# Altium schematic sheet J-Link-OB.SchDoc
size A3; SheetNumber: 8; SheetTotal: 8; DocumentSheetName: J-Link OB
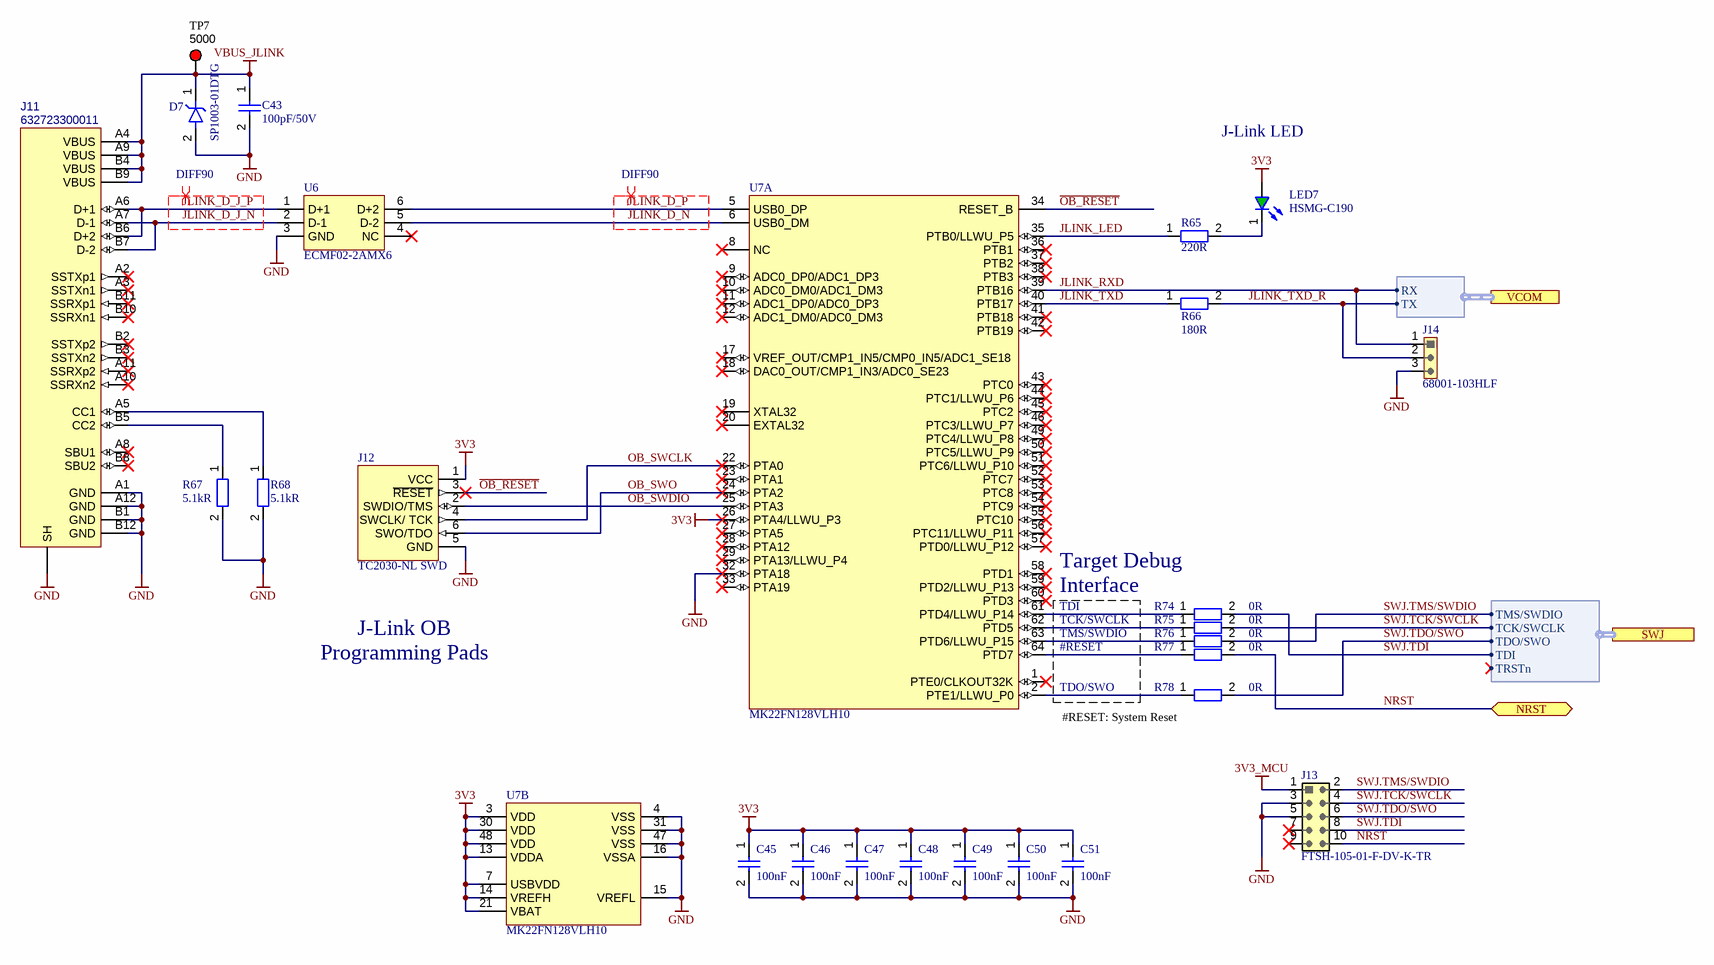
[diagram p0: J-Link-OB.SchDoc]

## Parts
C43  100pF/50V  [CAPC1005X50N]
C45  value 100nF  [CAPC1005X50N]  (hidden comment: 100nF/16V)
C46  value 100nF  [CAPC1005X50N]  (hidden comment: 100nF/16V)
C47  value 100nF  [CAPC1005X50N]  (hidden comment: 100nF/16V)
C48  value 100nF  [CAPC1005X50N]  (hidden comment: 100nF/16V)
C49  value 100nF  [CAPC1005X50N]  (hidden comment: 100nF/16V)
C50  value 100nF  [CAPC1005X50N]  (hidden comment: 100nF/16V)
C51  value 100nF  [CAPC1005X50N]  (hidden comment: 100nF/16V)
D7  SP1003-01DTG  [SOD14060X55N]
J11  632723300011  [WE_632723300011]
J12  TC2030-NL SWD  [TC2030-NL]  (no BOM)
J13  FTSH-105-01-F-DV-K-TR  [FP-FTSH-105-01-F-DV-K-TR-MFG]
J14  68001-103HLF  [HD254_1x3_MV]
LED7  HSMG-C190  [LEDSC160X80X80-2Lgn]
R65  220R  [RESC1608X45N]
R66  180R  [RESC1608X45N]
R67  5.1kR  [RESC1005X35N]
R68  5.1kR  [RESC1005X35N]
R74  0R  [RESC1005X35N]
R75  0R  [RESC1005X35N]
R76  0R  [RESC1005X35N]
R77  0R  [RESC1005X35N]
R78  0R  [RESC1005X35N]
TP7  5000  [KSTN-5000]
U6  ECMF02-2AMX6  [QFN50P150X170X50-6N]
U7  MK22FN128VLH10  [QFP50P1200X1200X160-64L]  (parts A,B of 2)

## Ports
NRST (bidir), SWJ (harness SWJ), VCOM (harness VCOM)

## Harnesses
VCOM: RX, TX
SWJ: TMS/SWDIO, TCK/SWCLK, TDO/SWO, TDI, TRSTn

## Nets
3V3: C45.1 C46.1 C47.1 C48.1 C49.1 C50.1 C51.1 J12.1(VCC) LED7.2(A) U7.3(VDD) U7.7(USBVDD) U7.13(VDDA) U7.14(VREFH) U7.21(VBAT) U7.26(PTA4/LLWU_P3) U7.30(VDD) U7.48(VDD)
3V3_MCU: J13.1
GND: C43.2 C45.2 C46.2 C47.2 C48.2 C49.2 C50.2 C51.2 D7.2(A) J11.A1(GND) J11.A12(GND) J11.B1(GND) J11.B12(GND) J11.SH J12.5(GND) J13.3 J13.5 J14.3 R67.2 R68.2 U6.3(GND) U7.4(VSS) U7.15(VREFL) U7.16(VSSA) U7.31(VSS) U7.32(PTA18) U7.47(VSS)
VBUS_JLINK: C43.1 D7.1(A) J11.A4(VBUS) J11.A9(VBUS) J11.B4(VBUS) J11.B9(VBUS) TP7.1
JLINK_D_J_N: J11.A7(D-1) J11.B7(D-2) U6.2(D-1)
JLINK_D_J_P: J11.A6(D+1) J11.B6(D+2) U6.1(D+1)
JLINK_D_N: U6.5(D-2) U7.6(USB0_DM)
JLINK_D_P: U6.6(D+2) U7.5(USB0_DP)
JLINK_LED: R65.1 U7.35(PTB0/LLWU_P5)
JLINK_RXD: J14.1 U7.39(PTB16) ; port VCOM.RX
JLINK_TXD: R66.1 U7.40(PTB17)
JLINK_TXD_R: J14.2 R66.2 ; port VCOM.TX
NRST: J13.10 R77.2 ; port NRST
~{OB_RESET}: J12.3(~{RESET}) U7.34(RESET_B)
OB_SWCLK: J12.4(SWCLK/_TCK) U7.22(PTA0)
OB_SWDIO: J12.2(SWDIO/TMS) U7.25(PTA3)
OB_SWO: J12.6(SWO/TDO) U7.24(PTA2)
SWJ.TCK/SWCLK: J13.4 R75.2 ; port SWJ.TCK/SWCLK
SWJ.TDI: J13.8 R74.2 ; port SWJ.TDI
SWJ.TDO/SWO: J13.6 R78.2 ; port SWJ.TDO/SWO
SWJ.TMS/SWDIO: J13.2 R76.2 ; port SWJ.TMS/SWDIO
NetJ11_A5: J11.A5(CC1) R68.1
NetJ11_B5: J11.B5(CC2) R67.1
NetLED7_1: LED7.1(K) R65.2
NetR74_1: R74.1 U7.61(PTD4/LLWU_P14)
NetR75_1: R75.1 U7.62(PTD5)
NetR76_1: R76.1 U7.63(PTD6/LLWU_P15)
NetR77_1: R77.1 U7.64(PTD7)
NetR78_1: R78.1 U7.2(PTE1/LLWU_P0)

Not connected (* = marked no-connect by the designer): J11 A2(SSTXp1)* A3(SSTXn1)* A8(SBU1)* A10(SSRXn2)* A11(SSRXp2)* B2(SSTXp2)* B3(SSTXn2)* B8(SBU2)* B10(SSRXn1)* B11(SSRXp1)*; J13 7* 9*; U6 4(NC)*; U7 1(PTE0/CLKOUT32K)* 8(NC)* 9(ADC0_DP0/ADC1_DP3)* 10(ADC0_DM0/ADC1_DM3)* 11(ADC1_DP0/ADC0_DP3)* 12(ADC1_DM0/ADC0_DM3)* 17(VREF_OUT/CMP1_IN5/CMP0_IN5/ADC1_SE18)* 18(DAC0_OUT/CMP1_IN3/ADC0_SE23)* 19(XTAL32)* 20(EXTAL32)* 23(PTA1)* 27(PTA5)* 28(PTA12)* 29(PTA13/LLWU_P4)* 33(PTA19)* 36(PTB1)* 37(PTB2)* 38(PTB3)* 41(PTB18)* 42(PTB19)* 43(PTC0)* 44(PTC1/LLWU_P6)* 45(PTC2)* 46(PTC3/LLWU_P7)* 49(PTC4/LLWU_P8)* 50(PTC5/LLWU_P9)* 51(PTC6/LLWU_P10)* 52(PTC7)* 53(PTC8)* 54(PTC9)* 55(PTC10)* 56(PTC11/LLWU_P11)* 57(PTD0/LLWU_P12)* 58(PTD1)* 59(PTD2/LLWU_P13)* 60(PTD3)*

## Layout directives
differential pair; differential pair class DIFF90: JLINK_D_J_N, JLINK_D_J_P, JLINK_D_N, JLINK_D_P

## Notes on the sheet
- J-Link LED
- (near R74) Target Debug Interface
- J-Link OB Programming Pads
- (near U7) TDI
- (near U7) TCK/SWCLK
- (near U7) TMS/SWDIO
- (near U7) #RESET
- (near R78) #RESET: System Reset
- (near U7) TDO/SWO
- Sheet Name
- Project Name
- Variant:
- Doc Number
- File:
- Repo:
- Revision:
- Date:
- Author:
- VC Rev:
- Sheet

## Library data of the parts
C43 = CMP-001-00089-19: Cap MLCC, 100pF, 50V, C0G, 5%, 0402; Tolerance: 5%; Value: 100pF; Voltage Rating: 50V; Dielectricum: C0G; Type: MLCC; Case/Package: 0402; Mounting Technology: SMD; Case Code (Metric): 1005
C45-C51 = CMP-001-00001-22: Cap MLCC, 100nF, 16V, X7R, 5%,  0402; Dielectricum: X7R; Type: MLCC; Case Code (Metric): 1005; Voltage Rating: 16V; Case/Package: 0402; Mounting Technology: SMD; Tolerance: 5%
D7 = CMP-00873-4: TVS Diode, unidirectional, 5V, 7A, SOD723; Connection: single; Size: L1.00B0.60H0.55; Case/Package: SOD723; Mounting Technology: SMD; Peak Current: 7A; Rated Voltage: 5V; Direction: unidirectional
J11 = CMP-220-000000-8: USB-C, 24 Pin, Pitch 500um, 20V, Horizontal, SMD/THT, L11.2B8.74H2.96; Manufacturer: Wurth Elektronik; Pin Mapping: 2x12; Max Current: 5A; Connection: Pluggable; Pitch: 500µm; Gender: Female; Family Name: WR-USB Connectors; Max Voltage: 20V; Mounting Technology: SMD/THT; Angle: Horizontal; Size: L11.2B8.74H2.96; Pins: 24; Type: USB-C
J12 = CMP-002-00174-19: Land Pattern, Cortex Tag-Connect, 6 Pin, Pitch 1.27mm, no legs; Mating Part: Cortex Tag-Connect Debugger; Angle: Vertical; Connection: Pluggable; Pin Mapping: 2x3; Pitch: 1.27mm; Pins: 6; Type: Land Pattern; Family Name: Tag-Connect; Mounting Technology: SMD; Size: 0
J13 = CMP-001-0047-10: Box Header, FTSH-105, 2x5 Pin, Pitch 1.27mm, 3.4A, Vertical, SMD, L6.3B6.86H6; Manufacturer: Samtec Inc.; Connection: Pluggable; Gender: Male; Max Current: 3.4A; Angle: Vertical; Size: L6.3B6.86H6; Mounting Technology: SMD; Type: Box Header; Pitch: 1.27mm; Family Name: FTSH-105; Pins: 10
J14 = CMP-002-00127-12: Header, 1x3 Pin, Pitch 2.54mm, Male, Vertical, THT; Manufacturer: FCI; Mating Length: 5.84mm; Plating: Gold; Overall Contact Length: 11.43mm; Termination Length: 3.05mm; Pitch Row: 2.54mm; Pin Mapping: 1x3; Pins: 3; Mounting Technology: THT; Angle: Vertical; Pitch: 2.54mm; Insulation Height: 2.54mm; Gender: Male
LED7 = CMP-007-00013-24: LED, Green, 20mA, 2.2V, 0603; Case/Package: 0603; Rated Current: 20mA; Forward Voltage: 2.2V; Size: L1.6B0.8H0.8; Color: Green; Mounting Technology: SMD
R65 = CMP-009-00452-5: Res, 220R, 1%, 0.1W, 0603; Voltage Rating: 75V; Value: 220; Temperature Coefficient: 100ppm/°C; Power: 100mW; Mounting Technology: SMD; Case Code (Metric): 1608; Case/Package: 0603; Tolerance: 1%; Type: Fixed
R66 = CMP-009-00559-5: Res, 180R, 1%, 100mW, 0603; Voltage Rating: 75V; Value: 180; Mounting Technology: SMD; Case Code (Metric): 1608; Power: 100mW; Type: Fixed; Case/Package: 0603; Tolerance: 1%
R67 R68 = CMP-009-00255-13: Res, 5.1kR, 1%, 0.063W, 0402; Voltage Rating: 50V; Value: 5.1k; Power: 63mW; Case/Package: 0402; Case Code (Metric): 1005; Tolerance: 1%; Mounting Technology: SMD; Type: Fixed
R74-R78 = CMP-009-00148-34: Res, 0R, 1%, 0.063W, 0402; Value: 0; Power: 63mW; Voltage Rating: 50V; Case/Package: 0402; Tolerance: 1%; Mounting Technology: SMD; Case Code (Metric): 1005; Type: Fixed
TP7 = CMP-00067-9: Test Point, Red, D2.5H4.6, THT, closed ring D1.25; Mounting Technology: THT; Color: Red; Size: D2.5H4.6
U6 = CMP-00721-6: ESD Common Mode Filter, Diodes and CM-Chocke, 6Vbr, 1.8ohm, 8kVpp, uQFN-6L, USB 2.0, MIPI D-PHY/MDDI; Specification: 6Vbr, 1.8ohm, 8kVpp; Type: ESD Common Mode Filter; Size: L1.7B1.5H0.5; Case/Package: uQFN-6L; Mounting Technology: SMD; Connection: Diodes and CM-Chocke
U7 = CMP-00769-8: Microcontroller, ARM Cortex-M4, 32MHz, Flash 128kB, RAM 24kB, QFN-64; Min Supply Voltage: 1.71V; Bit: 64; Max Supply Voltage: 3.6V; Frequency: 100MHz; Mounting Technology: SMD; RAM Size: 24kB; Type: Microcontroller; Size: L10B10H1.4; Case/Package: QFN-64; Family: ARM Cortex-M4; Flash Size: 128kB